# EAGLE schematic ultrasonic_sensor (EAGLE 8.2.0)
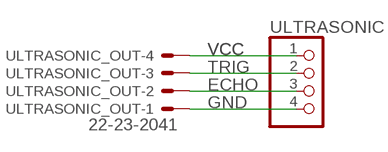
[diagram p0: schematic, sheet 1]

## Parts
ULTRASONIC  PINHD-1X4  [1X04]
ULTRASONIC_OUT  22-23-2041  [22-23-2041]

## Nets
ECHO: ULTRASONIC.3 ULTRASONIC_OUT.2
GND: ULTRASONIC.4 ULTRASONIC_OUT.1
TRIG: ULTRASONIC.2 ULTRASONIC_OUT.3
VCC: ULTRASONIC.1 ULTRASONIC_OUT.4

## Library data of the parts
ULTRASONIC = pinhead:PINHD-1X4: PIN HEADER
ULTRASONIC_OUT = con-molex:22-23-2041: .100" (2.54mm) Center Header - 4 Pin; MF: MOLEX; MPN: 22-23-2041; OC_FARNELL: 1462920; OC_NEWARK: 38C0355